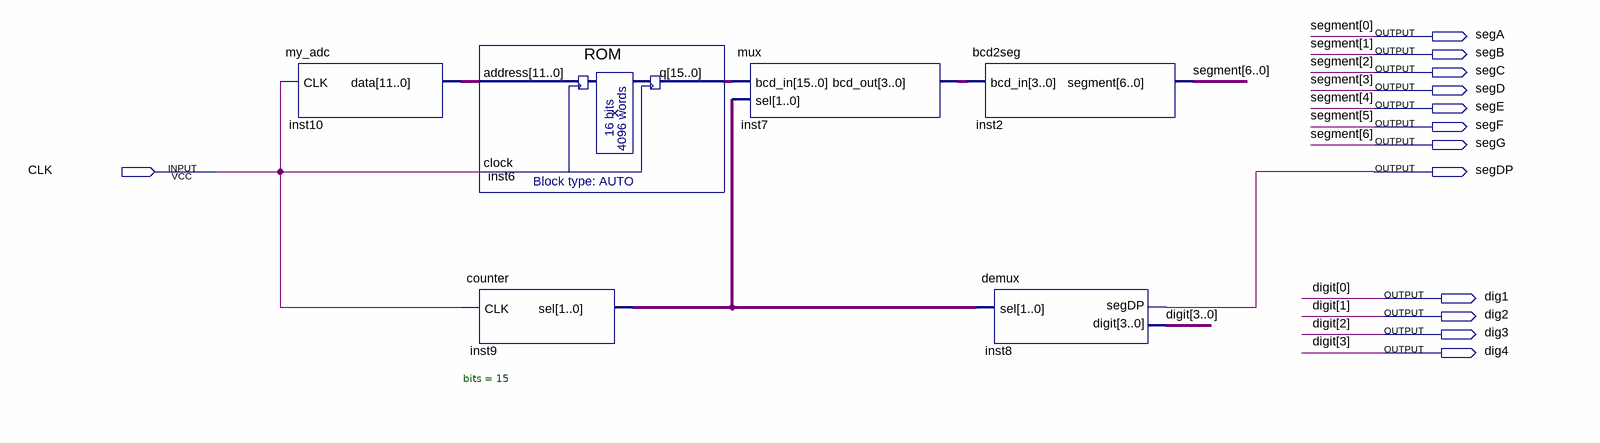
[diagram p0: schematic sheet]
// Quartus schematic Top.bdf as structural Verilog: 6 symbols, 13 pins
module Top (
  input  CLK,
  output segA,
  output segB,
  output segC,
  output segD,
  output segE,
  output segF,
  output segG,
  output segDP,
  output dig1,
  output dig2,
  output dig3,
  output dig4
);

  wire [1:0] inst9_sel;
  wire [3:0] inst7_bcd_out;
  wire [11:0] inst10_data;
  wire [15:0] inst6_q;

  my_adc inst10 (.CLK(CLK), .data(inst10_data));
  ROM inst6 (.address(inst10_data), .clock(CLK), .q(inst6_q));
  counter #(.bits(15)) inst9 (.CLK(CLK), .sel(inst9_sel));
  mux inst7 (.bcd_in(inst6_q), .sel(inst9_sel), .bcd_out(inst7_bcd_out));
  bcd2seg inst2 (.bcd_in(inst7_bcd_out), .segment({segG, segF, segE, segD, segC, segB, segA}));
  demux inst8 (.sel(inst9_sel), .digit({dig4, dig3, dig2, dig1}), .segDP(segDP));

  // Other names for the same wires on the sheet: digit[3:0] = {dig4, dig3, dig2, dig1};
  //   segment[6:0] = {segG, segF, segE, segD, segC, segB, segA}
endmodule
